# EAGLE design Dipolefeed (EAGLE 9.5.0)
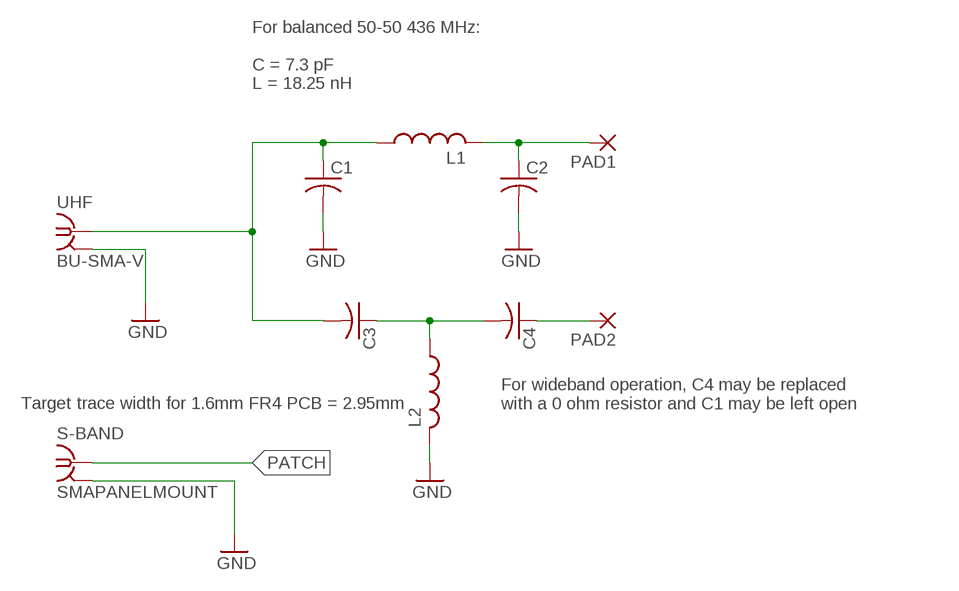
[diagram p0: schematic, sheet 1]

## Parts
C1  C-USC1608  [C1608]
C2  C-USC1608  [C1608]
C3  C-USC1608  [C1608]
C4  C-USC1608  [C1608]
L1  L-USL2012C  [L2012C]
L2  L-USL2012C  [L2012C]
PAD1  0  ANTENNAPAD2  [CMMOUNTPAD2]
PAD2  180  ANTENNAPAD2  [CMMOUNTPAD2]
S-BAND  SMAPANELMOUNT  [PANELSMA]
UHF  BU-SMA-V  [BU-SMA-V]

## Nets
GND: C1.2 C2.2 L2.2 S-BAND.P$2 S-BAND.P$3 UHF.2 UHF.3 UHF.4 UHF.5
N$1: C2.1 L1.2 PAD1.P$1(P)
N$2: C3.1 C4.2 L2.1
N$3: C4.1 PAD2.P$1(P)
N$4: C1.1 C3.2 L1.1 UHF.1
PATCH: S-BAND.P$1

## Notes on the sheet
- For balanced 50-50 436 MHz:
  
  C = 7.3 pF
  L = 18.25 nH
- Target trace width for 1.6mm FR4 PCB = 2.95mm
- For wideband operation, C4 may be replaced 
  with a 0 ohm resistor and C1 may be left open

## Library data of the parts
C1-C4 = resistor:C-US: CAPACITOR, American symbol
L1 L2 = rcl:L-US: INDUCTOR, American symbol
PAD1 PAD2 = AntennaPad:ANTENNAPAD2
S-BAND = AntennaPad:SMAPANELMOUNT
UHF = con-coax:BU-SMA-V: FEMALE SMA CONNECTOR Radiall distributor RS 112-3794; OC_FARNELL: unknown; OC_NEWARK: unknown

## Board
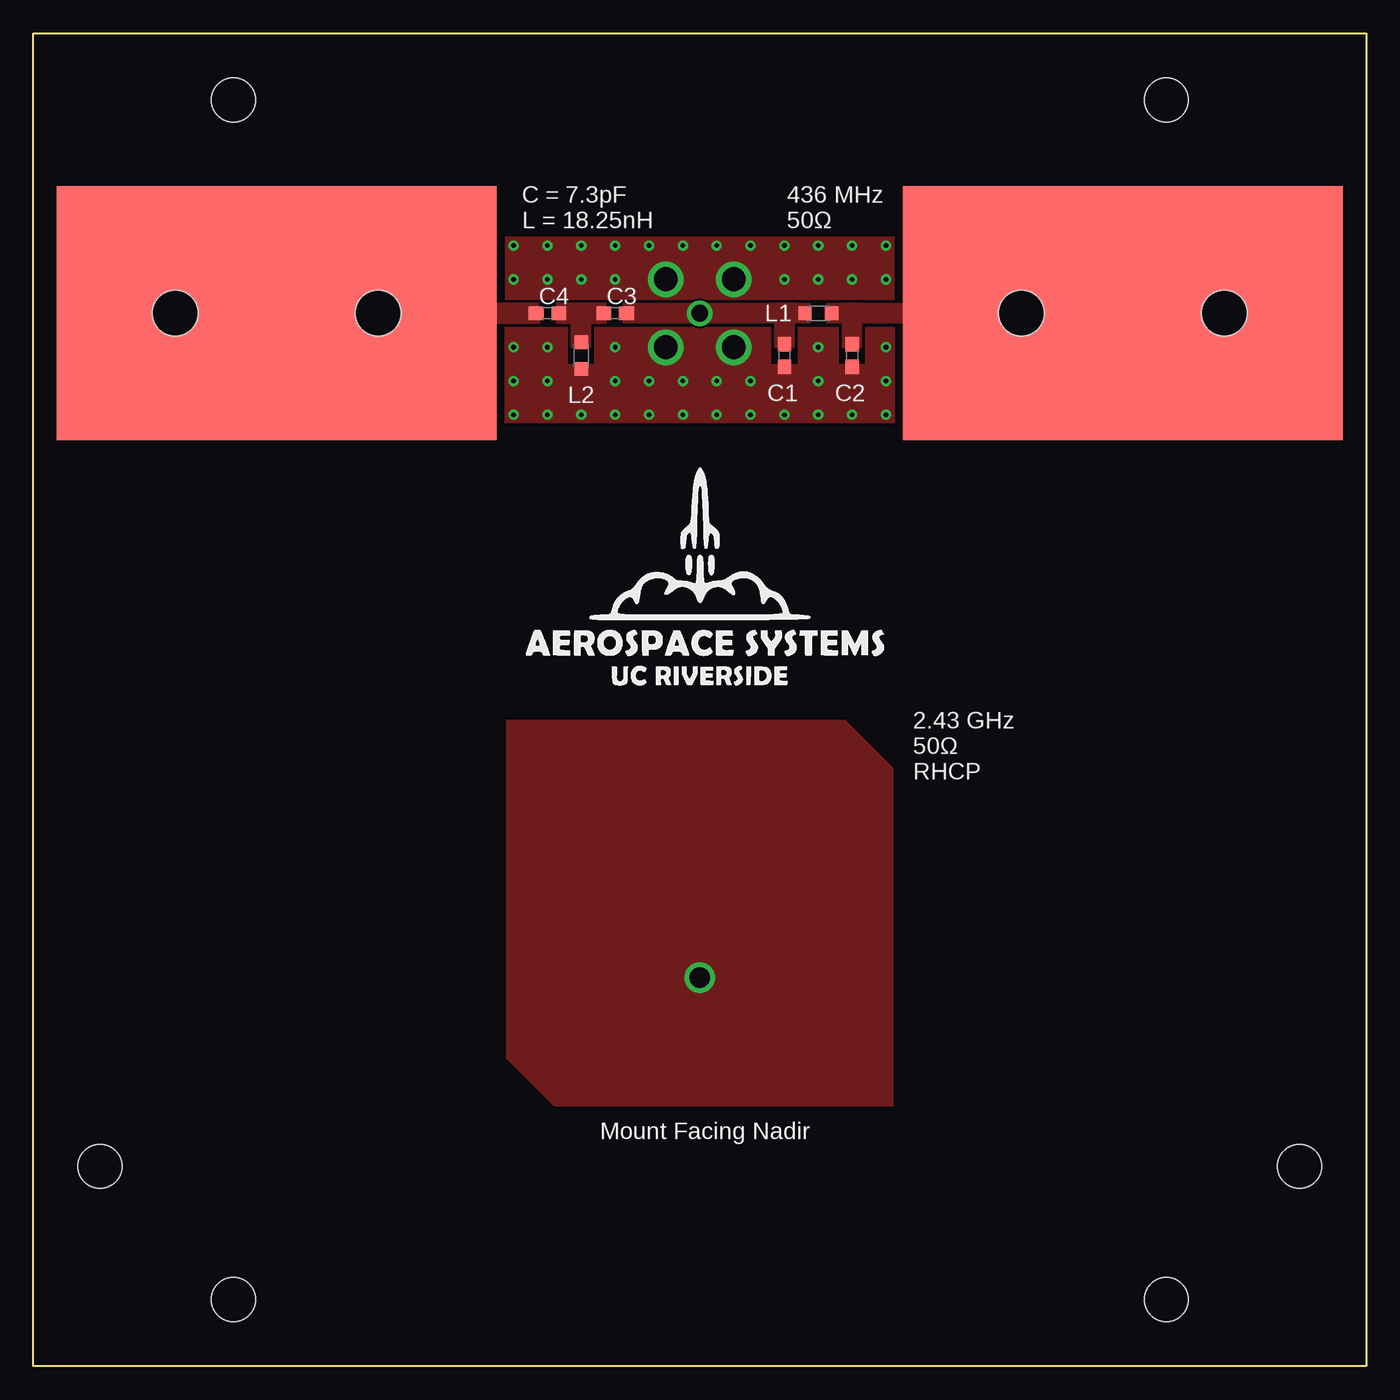
[diagram p1: board, top side]
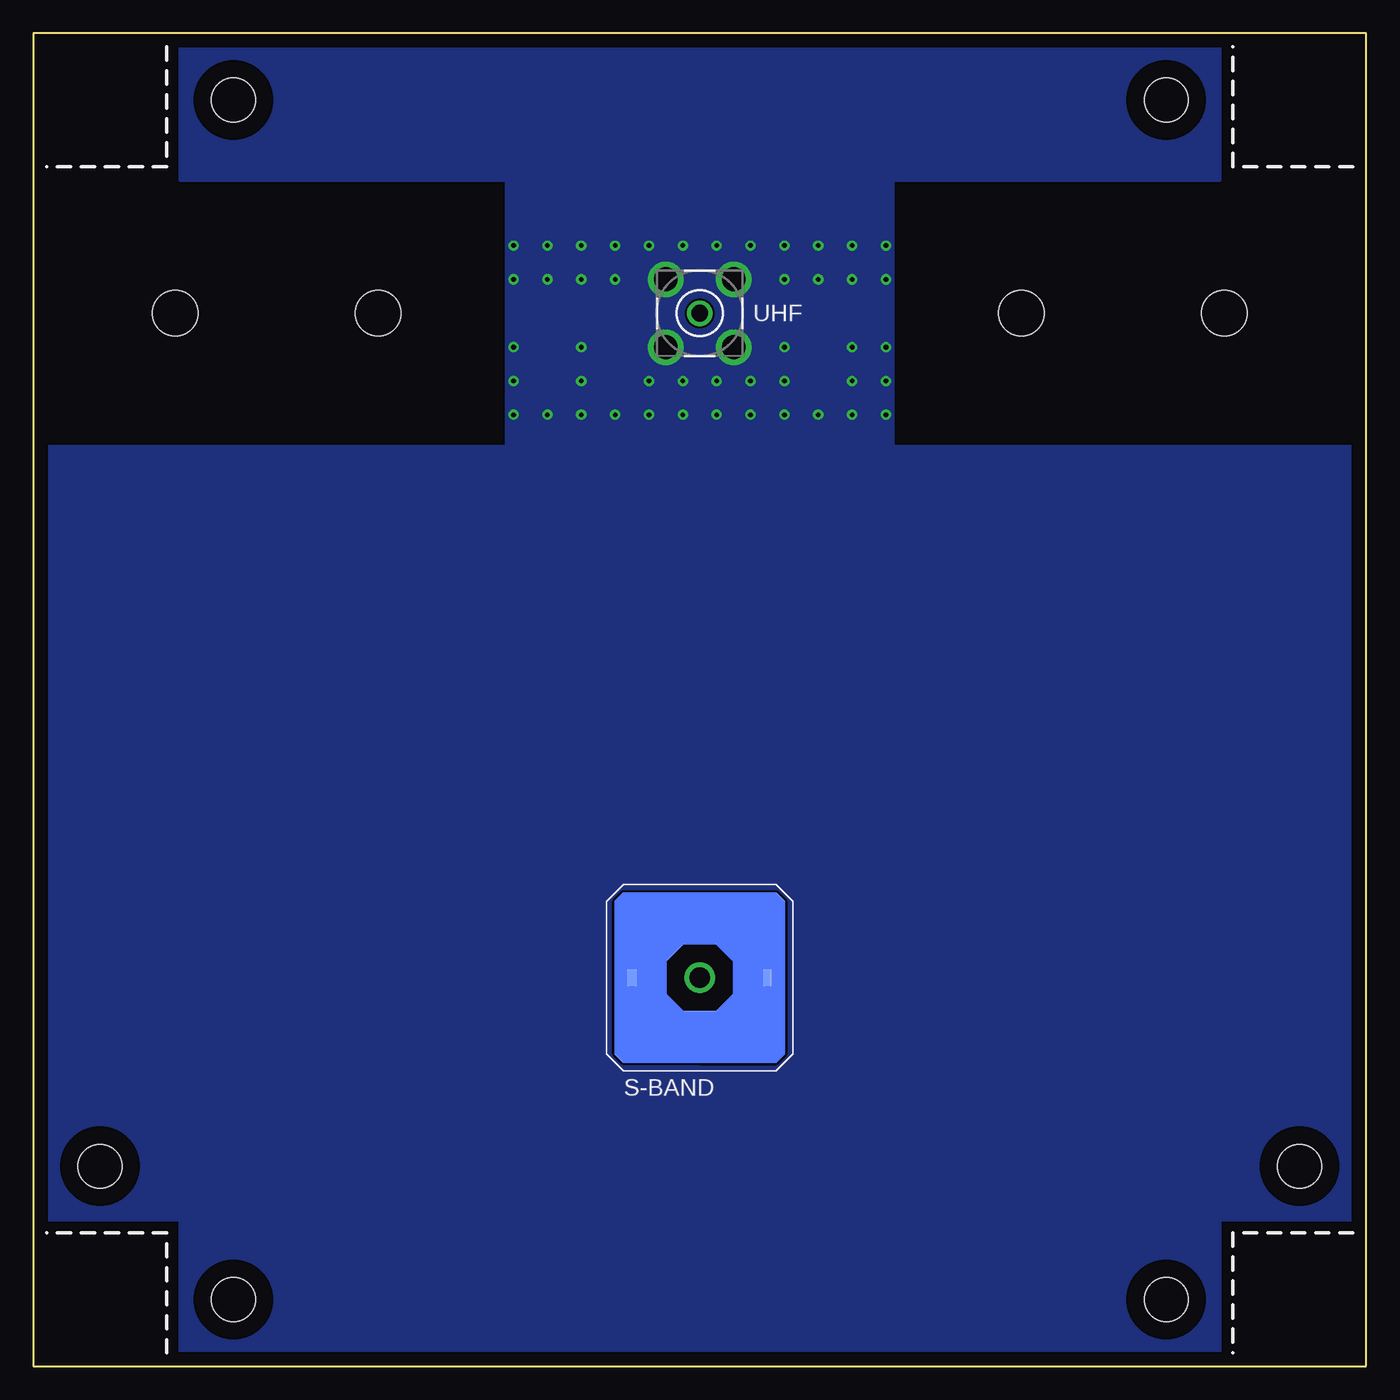
[diagram p2: board, bottom side, seen from below]

Size 100 x 100 mm. Coordinates in mm from the lower left corner, seen from the top.
Outline: 100,100 100,0 0,0 0,100 100,100
Copper layers (1*16): Top 0.035mm / dielectric 1.5mm / Bottom 0.035mm
Design rules "default": minimum track width 6mil, minimum drill 0.35mm, track to track 6mil, track to pad 6mil, pad to pad 6mil, via to via 6mil, smd to smd 6mil, copper to edge 40mil, drill to drill 6mil, minimum pad ring 10mil, minimum via ring 8mil, stop-mask expansion 4mil, vias tented up to drill 0mil, thermal gap 10mil
Holes 3.3 mm at 15,5 85,5 15,95 85,95 5,15 95,15
tRestrict: area 12.8,2.8 to 17.2,7.2; area 82.8,2.8 to 87.2,7.2; area 12.8,92.8 to 17.2,97.2; area 82.8,92.8 to 87.2,97.2; area 2.8,12.8 to 7.2,17.2; area 92.8,12.8 to 97.2,17.2
bRestrict: area 12.8,2.8 to 17.2,7.2; area 82.8,2.8 to 87.2,7.2; area 12.8,92.8 to 17.2,97.2; area 82.8,92.8 to 87.2,97.2; area 2.8,12.8 to 7.2,17.2; area 92.8,12.8 to 97.2,17.2

### Footprints (pad centres in the part's own frame; a part is rotated, then mirrored left to right if it is on the bottom)
C1608 = smd 1.1 x 1: 1 -0.85,0; 2 0.85,0
L2012C = smd 1 x 1: 1 -1,0; 2 1,0
CMMOUNTPAD2 = smd 33.02 x 19.05: P$1 0,0 | hole 3.429: -7.62,0; 7.62,0
PANELSMA = drill 1.524: P$1 0,0 | smd 0.635 x 1.27: P$2 -5.08,0; P$3 5.08,0
BU-SMA-V = drill 1.27: 1 0,0 | drill 1.778: 2 -2.55,2.55; 3 2.55,2.55; 4 2.55,-2.55; 5 -2.55,-2.55

### Placement (x,y rotation side)
C1  56.35,75.83 270 top
C2  61.43,75.83 270 top
C3  43.65,79 0 top
C4  38.57,79 0 top
L1  58.89,79 0 top
L2  41.11,75.83 270 top
PAD1  81.75,79 0 top
PAD2  18.25,79 0 top
S-BAND  50,29.15 0 bottom
UHF  50,79 0 bottom

### Tracks (layer width: path | path; a pad name or v marks a point on that pad's centre or on a via)
GND  (via drill 0.35)
  other vias: 38.57,76.46 36.03,76.46 36.03,81.54 38.57,81.54 41.11,81.54 43.65,81.54 63.97,81.54 61.43,81.54 58.89,81.54 56.35,81.54 43.65,84.08 46.19,84.08 48.73,84.08 51.27,84.08 53.81,84.08 56.35,84.08 43.65,76.46 43.65,73.92 46.19,73.92 48.73,73.92 51.27,73.92 53.81,73.92 53.81,71.38 43.65,71.38 41.11,71.38 38.57,71.38 38.57,73.92 56.35,71.38 58.89,71.38 58.89,73.92 58.89,76.46 61.43,71.38 63.97,71.38 63.97,73.92 63.97,76.46 46.19,71.38 48.73,71.38 51.27,71.38 36.03,73.92 36.03,71.38 41.11,84.08 38.57,84.08 36.03,84.08 58.89,84.08 61.43,84.08 63.97,84.08
  pour Bottom (no thermals): 11,0 89,0 89,11 100,11 100,69 0,69 0,11 11,11
  pour Bottom (no thermals): 11,100 11,89 35.5,89 35.5,69 64.5,69 64.5,89 89,89 89,100
  pour Top (no thermals): 35.4,80.05 64.6,80.05 64.6,84.72 35.4,84.72
  pour Top (no thermals): 35.4,77.95 40.06,77.95 40.06,75.19 42.16,75.19 42.16,77.95 55.3,77.95 55.3,75.19 57.4,75.19 57.4,77.95 60.38,77.95 60.38,75.19 62.48,75.19 62.48,77.95 64.6,77.95 64.6,70.75 35.4,70.75
N$1
  pour Top (no thermals): 59.52,79 59.52,79.75 65.75,79.75 65.75,78.25 59.52,78.25
  pour Top (no thermals): 60.68,76.46 62.18,76.46 62.18,79.75 60.68,79.75
N$2
  pour Top (no thermals): 43.02,79.75 39.2,79.75 39.2,78.25 43.02,78.25
  pour Top (no thermals): 40.36,76.46 41.86,76.46 41.86,79.75 40.36,79.75
N$3
  pour Top (no thermals): 37.94,79 37.94,79.75 34.25,79.75 34.25,78.25 38,78.25
N$4
  pour Top (no thermals): 44.28,78.25 44.28,79.75 58.26,79.75 58.26,78.25
  pour Top (no thermals): 55.6,76.46 57.1,76.46 57.1,79.75 55.6,79.75
PATCH
  pour Top (no thermals): 64.5,19.5 39.1,19.5 35.5,23.1 35.5,48.5 60.9,48.5 64.5,44.9

### Text on the board
tPlace: C = 7.3pF / L = 18.25nH | 436 MHz / 50Ω | 2.43 GHz / 50Ω / RHCP | Mount Facing Nadir